# Altium schematic sheet RGBParkLight.SCHDOC
size B
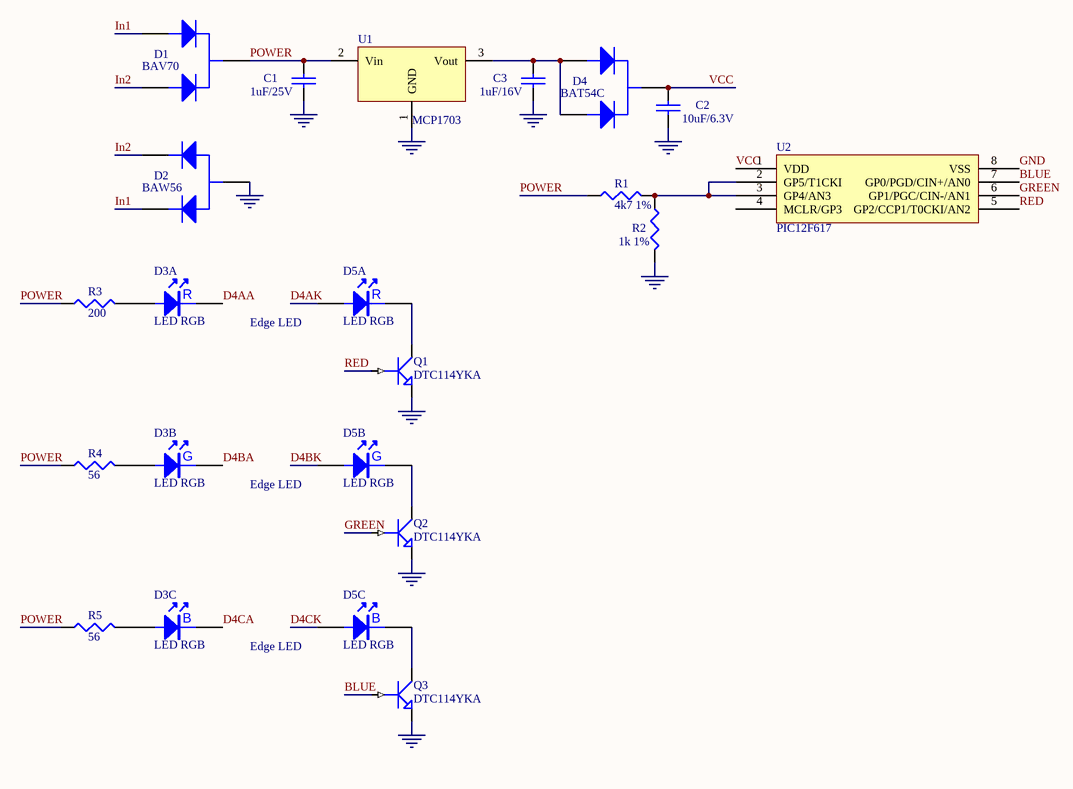
[diagram p0: RGBParkLight.SCHDOC]

## Parts
C1  1uF/25V  [0805]
C2  10uF/6.3V  [0805]
C3  1uF/16V  [0603]
D1  BAV70  [SOT-23]
D2  BAW56  [SOT-23]
D3  (no value)  [AF-5060]  (parts A,B,C of 3)
D4  BAT54C  [SOT-23]
D5  (no value)  [AF-5060]  (parts A,B,C of 3)
Q1  DTC114YKA  [SOT-23]
Q2  DTC114YKA  [SOT-23]
Q3  DTC114YKA  [SOT-23]
R1  4k7 1%  [0603]
R2  1k 1%  [0603]
R3  200  [0805]
R4  56  [0805]
R5  56  [0805]
U1  MCP1703  [SOT-23]
U2  PIC12F617  [SO-8]

## Nets
GND: C1.2 C2.2 C3.2 D2.2(A) Q1.3(E) Q2.3(E) Q3.3(E) R2.2 U1.1(GND) U2.8(VSS)
BLUE: Q3.1(B) U2.7(GP0/PGD/CIN+/AN0)
D4AA: D3.4(K)
D4AK: D5.3(A)
D4BA: D3.5(K)
D4BK: D5.2(A)
D4CA: D3.6(K)
D4CK: D5.1(A)
GREEN: Q2.1(B) U2.6(GP1/PGC/CIN-/AN1)
In1: D1.1(A1) D2.3(K2)
In2: D1.3(A2) D2.1(K1)
POWER: C1.1 D1.2(K) R1.1 R3.1 R4.1 R5.1 U1.2(Vin)
RED: Q1.1(B) U2.5(GP2/CCP1/T0CKI/AN2)
VCC: C2.1 D4.2(K) U2.1(VDD)
NetC3_1: C3.1 D4.1(A1) D4.3(A2) U1.3(Vout)
NetD3_1: D3.1(A) R5.2
NetD3_2: D3.2(A) R4.2
NetD3_3: D3.3(A) R3.2
NetD5_4: D5.4(K) Q1.2(C)
NetD5_5: D5.5(K) Q2.2(C)
NetD5_6: D5.6(K) Q3.2(C)
NetR1_2: R1.2 R2.1 U2.2(GP5/T1CKI) U2.3(GP4/AN3)

Not connected (* = marked no-connect by the designer): U2 4(MCLR/GP3)

## Notes on the sheet
- Edge LED
- (in symbol LED RGB, part A) R
- (in symbol LED RGB, part B) G
- (in symbol LED RGB, part C) B

## Library data of the parts
C1-C3 = CAP: Capacitor
D1 D4 = DUAL DIODE BAV70
D2 = DUAL DIODE BAW56
D3 D5 = LED RGB
Q1-Q3 = NPN1: NPN Transistor
R1-R5 = RES1
U1 = VOLTREG
U2 = PIC12F683